# EAGLE design CubePCB_sliceWithDIP (EAGLE 9.2.2)
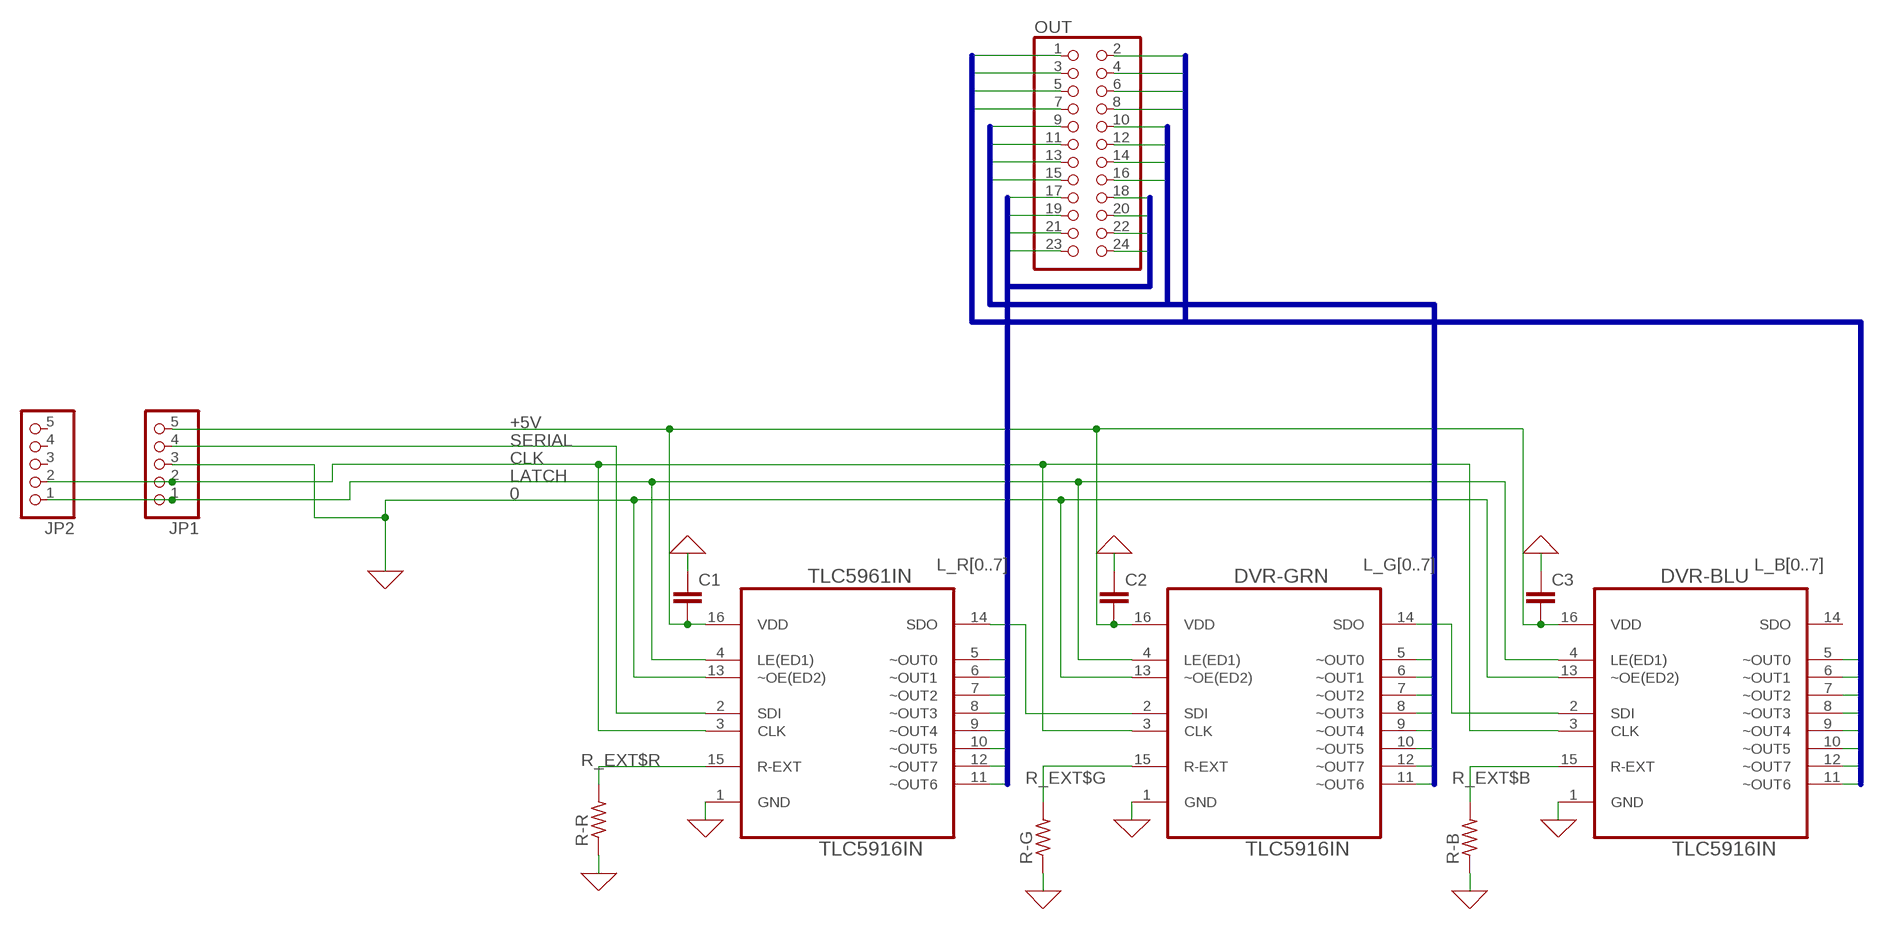
[diagram p0: schematic, sheet 1]

## Parts
C1  C2,5-3  [C2.5-3]
C2  C2,5-3  [C2.5-3]
C3  C2,5-3  [C2.5-3]
DVR-BLU  TLC5916IN  [DIP254P762X508-16]
DVR-GRN  TLC5916IN  [DIP254P762X508-16]
JP1  PINHD-1X5  [1X05]
JP2  PINHD-1X5  [1X05]
OUT  PINHD-2X12  [2X12]
R-B  R-US_0204/7  [0204/7]
R-G  R-US_0204/7  [0204/7]
R-R  R-US_0204/7  [0204/7]
TLC5961IN  TLC5916IN  [DIP254P762X508-16]

## Nets
0: C1.1 C2.1 C3.1 DVR-BLU.1(GND) DVR-BLU.13(~OE(ED2)) DVR-GRN.1(GND) DVR-GRN.13(~OE(ED2)) JP1.3 R-B.1 R-G.1 R-R.1 TLC5961IN.1(GND) TLC5961IN.13(~OE(ED2)) ; supply symbol labelled GND
+5V: C1.2 C2.2 C3.2 DVR-BLU.16(VDD) DVR-GRN.16(VDD) JP1.5 TLC5961IN.16(VDD)
CLK: DVR-BLU.3(CLK) DVR-GRN.3(CLK) JP1.2 JP2.2 TLC5961IN.3(CLK)
L_B0: DVR-BLU.5(~OUT0) OUT.7
L_B1: DVR-BLU.6(~OUT1) OUT.8
L_B2: DVR-BLU.7(~OUT2) OUT.5
L_B3: DVR-BLU.8(~OUT3) OUT.6
L_B4: DVR-BLU.9(~OUT4) OUT.3
L_B5: DVR-BLU.10(~OUT5) OUT.4
L_B6: DVR-BLU.11(~OUT6) OUT.1
L_B7: DVR-BLU.12(~OUT7) OUT.2
L_G0: DVR-GRN.5(~OUT0) OUT.15
L_G1: DVR-GRN.6(~OUT1) OUT.16
L_G2: DVR-GRN.7(~OUT2) OUT.13
L_G3: DVR-GRN.8(~OUT3) OUT.14
L_G4: DVR-GRN.9(~OUT4) OUT.11
L_G5: DVR-GRN.10(~OUT5) OUT.12
L_G6: DVR-GRN.11(~OUT6) OUT.9
L_G7: DVR-GRN.12(~OUT7) OUT.10
L_R0: OUT.23 TLC5961IN.5(~OUT0)
L_R1: OUT.24 TLC5961IN.6(~OUT1)
L_R2: OUT.21 TLC5961IN.7(~OUT2)
L_R3: OUT.22 TLC5961IN.8(~OUT3)
L_R4: OUT.19 TLC5961IN.9(~OUT4)
L_R5: OUT.20 TLC5961IN.10(~OUT5)
L_R6: OUT.17 TLC5961IN.11(~OUT6)
L_R7: OUT.18 TLC5961IN.12(~OUT7)
LATCH: DVR-BLU.4(LE(ED1)) DVR-GRN.4(LE(ED1)) JP1.1 JP2.1 TLC5961IN.4(LE(ED1))
N$1: DVR-GRN.2(SDI) TLC5961IN.14(SDO)
N$2: DVR-BLU.2(SDI) DVR-GRN.14(SDO)
R_EXT$B: DVR-BLU.15(R-EXT) R-B.2
R_EXT$G: DVR-GRN.15(R-EXT) R-G.2
R_EXT$R: R-R.2 TLC5961IN.15(R-EXT)
SERIAL: JP1.4 TLC5961IN.2(SDI)
Unconnected: DVR-BLU.14(SDO) JP2.3 JP2.4 JP2.5

## Buses
L_R[0..7]
L_G[0..7]
L_B[0..7]

## Library data of the parts
C1-C3 = capacitor-wima:C: CAPACITOR naming: grid - package width
DVR-BLU DVR-GRN TLC5961IN = Texas Instruments_By_element14_Batch_1:TLC5916IN: 8-CHANNEL CONSTANT-CURRENT LED SINK DRIVERS; MPN: TLC5916IN; OC_FARNELL: 1647814; OC_NEWARK: 60M1749; PACKAGE: PDIP-16; SUPPLIER: Texas Instruments
JP1 JP2 = pinhead:PINHD-1X5: PIN HEADER
OUT = pinhead:PINHD-2X12: PIN HEADER
R-B R-G R-R = rcl:R-US_: RESISTOR, American symbol; SPICEPREFIX: R

## Module SLICE
Ports: +5V(io) SERIAL(io) CLK(io) LATCH(io) 0(io) ~OUT_EN(io)

### Library data of the parts

## Board
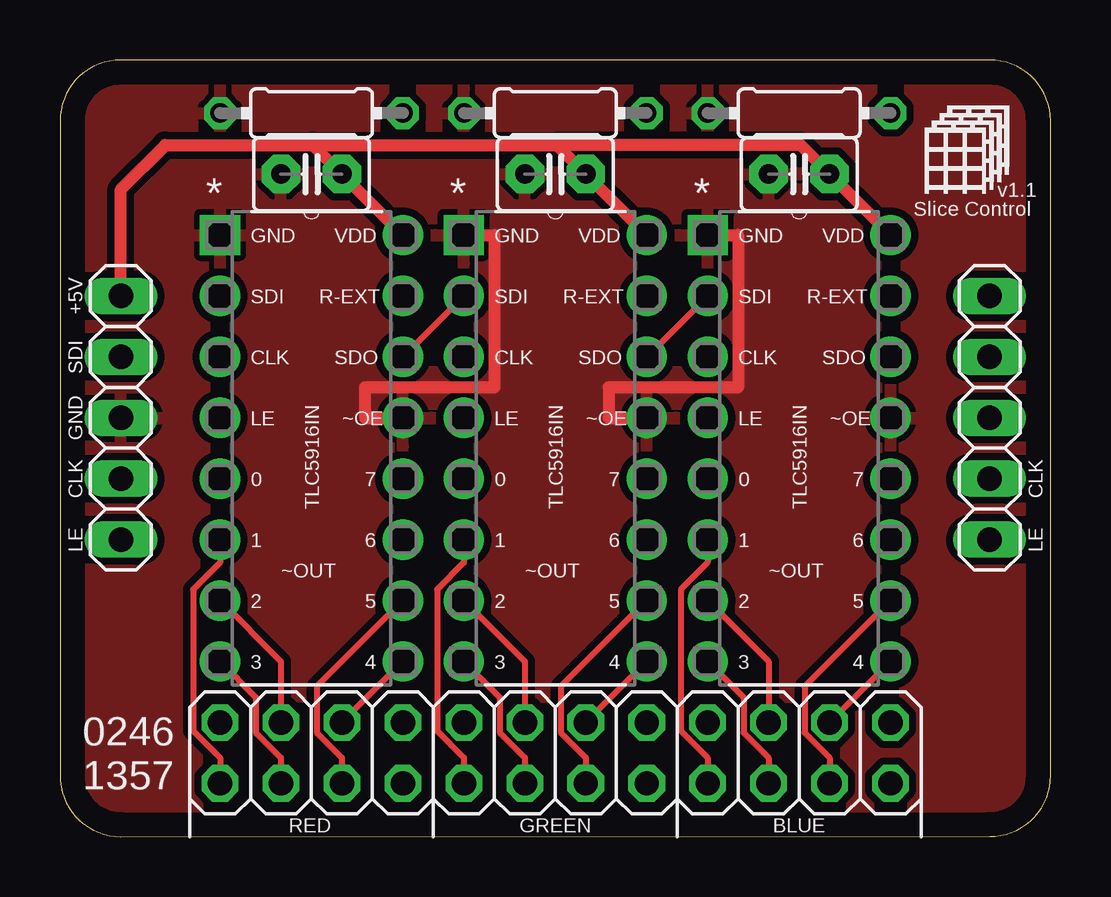
[diagram p1: board, top side]
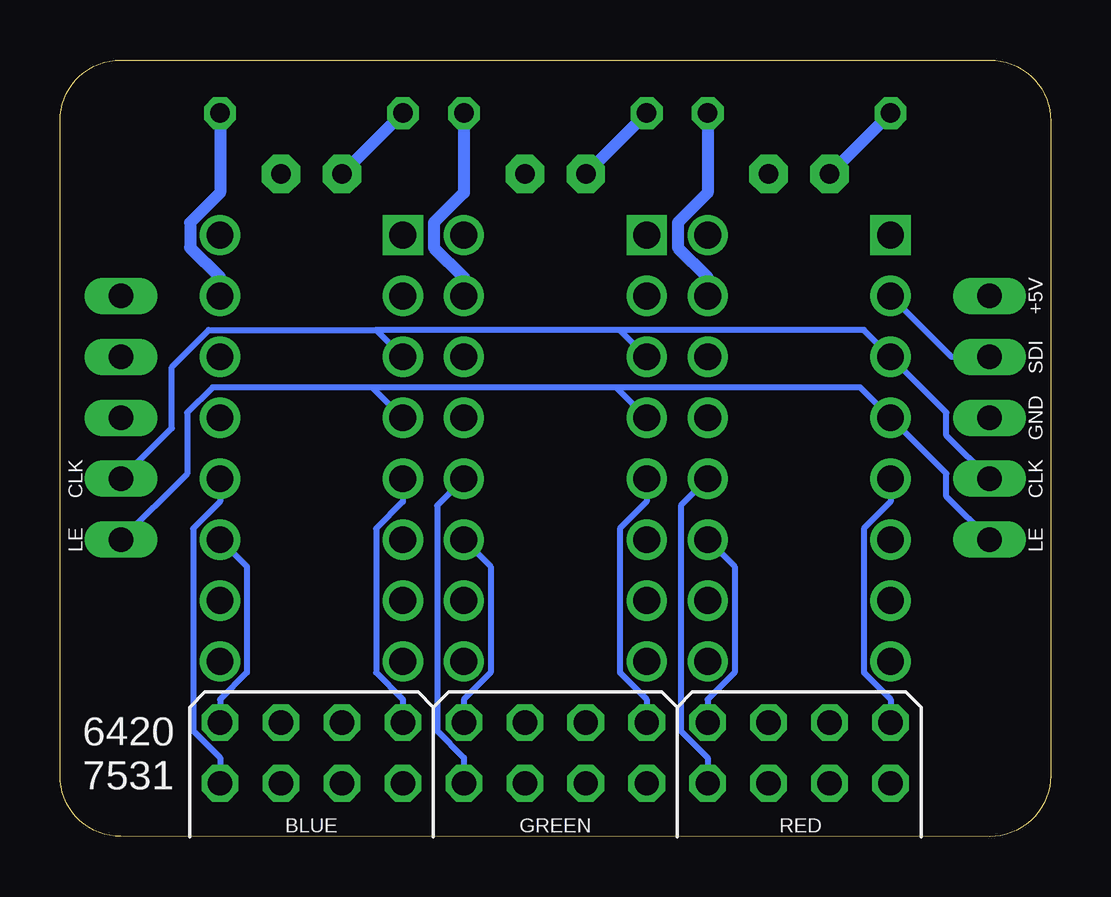
[diagram p2: board, bottom side, seen from below]

Size 41.27 x 32.38 mm. Coordinates in mm from the lower left corner, seen from the top.
Outline: 0,29.83 0,2.54 arc90 2.54,0 38.73,0 arc90 41.27,2.54 41.27,29.84 arc90 38.73,32.38 2.54,32.37 arc90 0,29.83
Copper layers (1*16): Top 0.035mm / dielectric 1.5mm / Bottom 0.035mm
Design rules "default *": minimum track width 10mil, minimum drill 0.35mm, track to track 10mil, track to pad 6mil, pad to pad 6mil, via to via 6mil, smd to smd 6mil, copper to edge 40mil, drill to drill 6mil, minimum pad ring 10mil, minimum via ring 8mil, stop-mask expansion 4mil, vias tented up to drill 0mil, thermal gap 10mil

### Footprints (pad centres in the part's own frame; a part is rotated, then mirrored left to right if it is on the bottom)
C2.5-3 = drill 0.813 pad 1.6 octagon: 1 -1.27,0; 2 1.27,0
DIP254P762X508-16 = drill 1.118 square: 1 -7.62,17.78 | drill 1.118: 2 -7.62,15.24; 3 -7.62,12.7; 4 -7.62,10.16; 5 -7.62,7.62; 6 -7.62,5.08; 7 -7.62,2.54; 8 -7.62,0; 9 0,0; 10 0,2.54; 11 0,5.08; 12 0,7.62; 13 0,10.16; 14 0,12.7; 15 0,15.24; 16 0,17.78
1X05 = drill 1.016 long: 1 -5.08,0; 2 -2.54,0; 3 0,0; 4 2.54,0; 5 5.08,0
2X12 = drill 1.016 octagon: 1 -13.97,-1.27; 2 -13.97,1.27; 3 -11.43,-1.27; 4 -11.43,1.27; 5 -8.89,-1.27; 6 -8.89,1.27; 7 -6.35,-1.27; 8 -6.35,1.27; 9 -3.81,-1.27; 10 -3.81,1.27; 11 -1.27,-1.27; 12 -1.27,1.27; 13 1.27,-1.27; 14 1.27,1.27; 15 3.81,-1.27; 16 3.81,1.27; 17 6.35,-1.27; 18 6.35,1.27; 19 8.89,-1.27; 20 8.89,1.27; 21 11.43,-1.27; 22 11.43,1.27; 23 13.97,-1.27; 24 13.97,1.27
0204/7 = drill 0.813 octagon: 1 -3.81,0; 2 3.81,0

### Placement (x,y rotation side)
C1  10.48,27.62 0 top
C2  20.64,27.62 0 top
C3  30.8,27.62 0 top
DVR-BLU  34.61,7.3 0 top
DVR-GRN  24.45,7.3 0 top
JP1  2.54,17.46 90 top
JP2  38.73,17.46 90 top
OUT  20.64,3.49 180 top
R-B  30.8,30.16 0 top
R-G  20.64,30.16 0 top
R-R  10.48,30.16 0 top
TLC5961IN  14.29,7.3 0 top

### Tracks (layer width: path | path; a pad name or v marks a point on that pad's centre or on a via)
0
  Top 0.508: TLC5961IN.13 12.7,17.46 12.7,18.73 18.1,18.73 18.1,25.08 DVR-GRN.1 | DVR-GRN.13 22.86,17.46 22.86,18.73 28.26,18.73 28.26,25.08 DVR-BLU.1
  Bottom 0.508: R-R.1 C1.1 | R-G.1 C2.1 | C3.1 R-B.1
  pour Top (isolate 0.305): 0,0 0,32.38 41.27,32.38 41.27,0
+5V
  Top 0.508: TLC5961IN.16 C1.2 10.54,28.83 | DVR-GRN.16 C2.2 20.7,28.83 | DVR-BLU.16 C3.2 30.86,28.83 20.7,28.83 | 10.54,28.83 4.38,28.83 2.54,26.99 JP1.5 | 10.54,28.83 20.7,28.83
CLK
  Bottom 0.254: 17.95,21.12 7.79,21.12 TLC5961IN.3 4.34,17.68 4.34,16.71 JP1.2 | 17.95,21.12 28.11,21.12 | 28.11,21.12 35.08,21.12 35.08,21.11 36.61,19.58 36.61,17.03 JP2.2 | DVR-GRN.3 17.95,21.12 | DVR-BLU.3 28.11,21.12
L_B0
  Bottom 0.254: OUT.7 26.99,5.72 28.11,6.84 28.11,12.84 26.99,13.96 DVR-BLU.5
L_B1
  Top 0.254: OUT.8 26.99,3.29 25.87,4.41 25.87,10.3 26.99,11.42 DVR-BLU.6
L_B2
  Top 0.254: OUT.5 29.53,7.3 DVR-BLU.7
L_B3
  Top 0.254: OUT.6 29.53,3.29 28.49,4.33 28.49,5.8 DVR-BLU.8
L_B4
  Top 0.254: DVR-BLU.9 OUT.3
L_B5
  Top 0.254: OUT.4 32.07,3.29 31.03,4.33 31.03,6.26 DVR-BLU.10
L_B6
  Bottom 0.254: DVR-BLU.11 33.49,11.26 33.49,6.84 34.61,5.72 OUT.1
L_B7
  Bottom 0.254: DVR-BLU.12 34.61,13.96 35.73,12.84 35.73,4.41 34.61,3.29 OUT.2
L_G0
  Bottom 0.254: DVR-GRN.5 16.83,13.96 17.95,12.84 17.95,6.84 16.83,5.72 OUT.15
L_G1
  Top 0.254: DVR-GRN.6 16.83,11.42 15.71,10.3 15.71,4.41 16.83,3.29 OUT.16
L_G2
  Top 0.254: DVR-GRN.7 19.37,7.3 OUT.13
L_G3
  Top 0.254: DVR-GRN.8 18.33,5.8 18.33,4.33 19.37,3.29 OUT.14
L_G4
  Top 0.254: DVR-GRN.9 OUT.11
L_G5
  Top 0.254: OUT.12 21.91,3.29 20.87,4.33 20.87,6.26 DVR-GRN.10
L_G6
  Bottom 0.254: OUT.9 24.45,5.72 23.33,6.84 23.33,11.26 DVR-GRN.11
L_G7
  Bottom 0.254: OUT.10 24.45,3.29 25.57,4.41 25.57,13.8 DVR-GRN.12
L_R0
  Bottom 0.254: TLC5961IN.5 6.67,13.96 7.79,12.84 7.79,6.84 6.67,5.72 OUT.23
L_R1
  Top 0.254: TLC5961IN.6 6.67,11.42 5.55,10.3 5.55,4.41 6.67,3.29 OUT.24
L_R2
  Top 0.254: TLC5961IN.7 9.21,7.3 OUT.21
L_R3
  Top 0.254: TLC5961IN.8 8.17,5.8 8.17,4.33 9.21,3.29 OUT.22
L_R4
  Top 0.254: TLC5961IN.9 OUT.19
L_R5
  Top 0.254: OUT.20 11.75,3.29 10.71,4.33 10.71,6.26 TLC5961IN.10
L_R6
  Bottom 0.254: OUT.17 14.29,5.72 13.17,6.84 13.17,11.26 TLC5961IN.11
L_R7
  Bottom 0.254: OUT.18 14.29,3.29 15.4,4.41 15.4,13.8 TLC5961IN.12
LATCH
  Bottom 0.254: 18.1,18.73 7.94,18.73 TLC5961IN.4 4.34,15.14 4.34,14.17 JP1.1 | 18.1,18.73 28.26,18.73 | 28.26,18.73 34.92,18.73 35.98,17.67 35.98,15.13 JP2.1 | DVR-GRN.4 18.1,18.73 | DVR-BLU.4 28.26,18.73
N$1
  Top 0.254: TLC5961IN.14 DVR-GRN.2
N$2
  Top 0.254: DVR-GRN.14 DVR-BLU.2
R_EXT$B
  Bottom 0.508: R-B.2 34.61,26.84 35.85,25.6 35.85,24.57 34.61,23.32 DVR-BLU.15
R_EXT$G
  Bottom 0.508: R-G.2 24.45,26.84 25.69,25.6 25.69,24.57 24.45,23.32 DVR-GRN.15
R_EXT$R
  Bottom 0.508: R-R.2 14.29,26.84 15.53,25.6 15.53,24.57 14.29,23.32 TLC5961IN.15
SERIAL
  Bottom 0.254: JP1.4 4.13,20 TLC5961IN.2

### Text on the board
tPlace: GND | VDD | GND | VDD | GND | VDD | +5V | SDI | R-EXT | SDI | R-EXT | SDI | R-EXT | SDI | CLK | SDO | CLK | SDO | CLK | SDO | GND | LE | ~OE | LE | ~OE | LE | ~OE | CLK | 0 | 7 | 0 | 7 | 0 | 7 | CLK | TLC5916IN | TLC5916IN | TLC5916IN | LE | 1 | 6 | 1 | 6 | 1 | 6 | LE | ~OUT | ~OUT | ~OUT | 2 | 5 | 2 | 5 | 2 | 5 | 3 | 4 | 3 | 4 | 3 | 4 | 0246 / 1357 | RED | GREEN | BLUE
bPlace: +5V | SDI | GND | CLK | CLK | LE | LE | 6420 / 7531 | RED | GREEN | BLUE
tNames: v1.1 | Slice Control